# EasyEDA Pro project Excam多功能小相机.epro, board PCB3
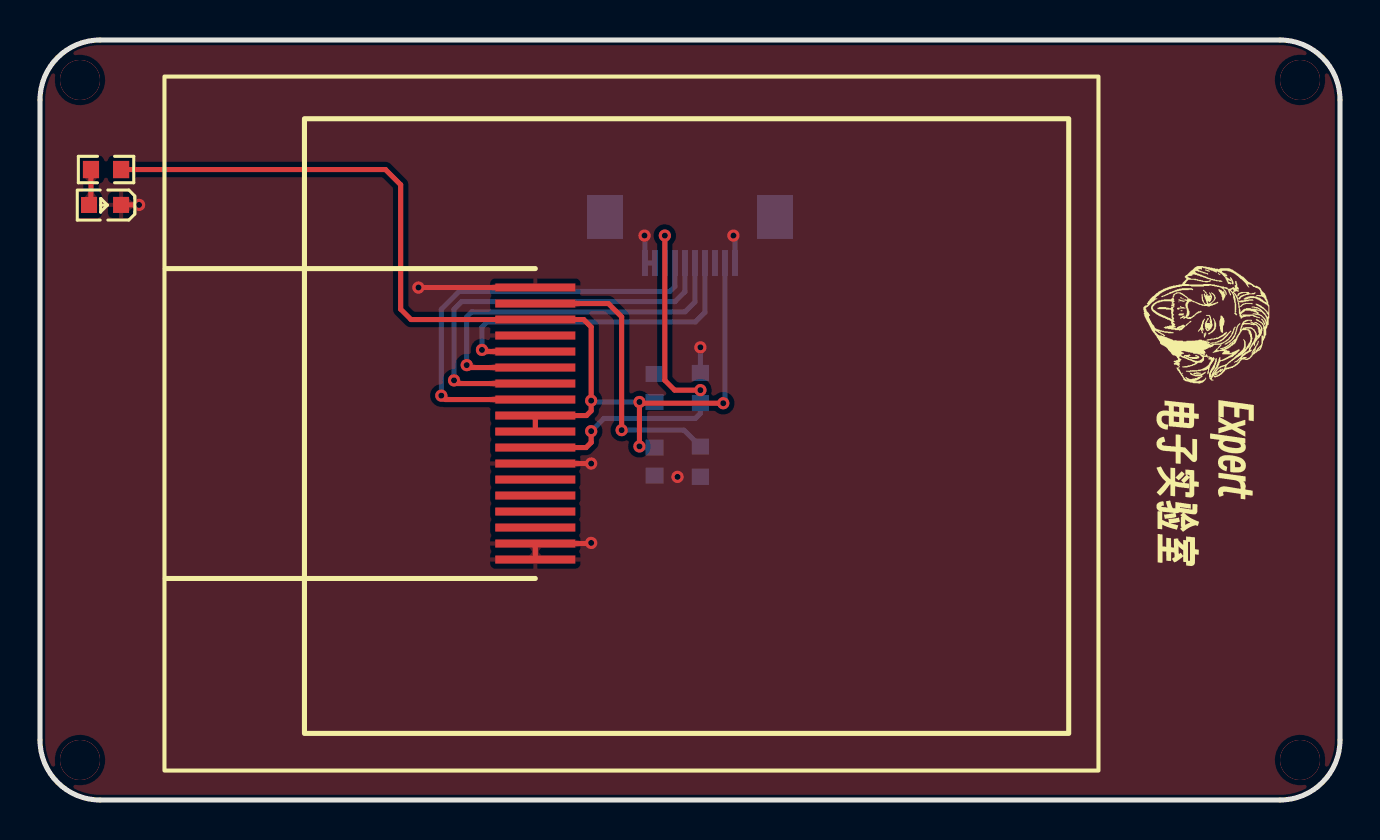
[diagram p2: board, top side]
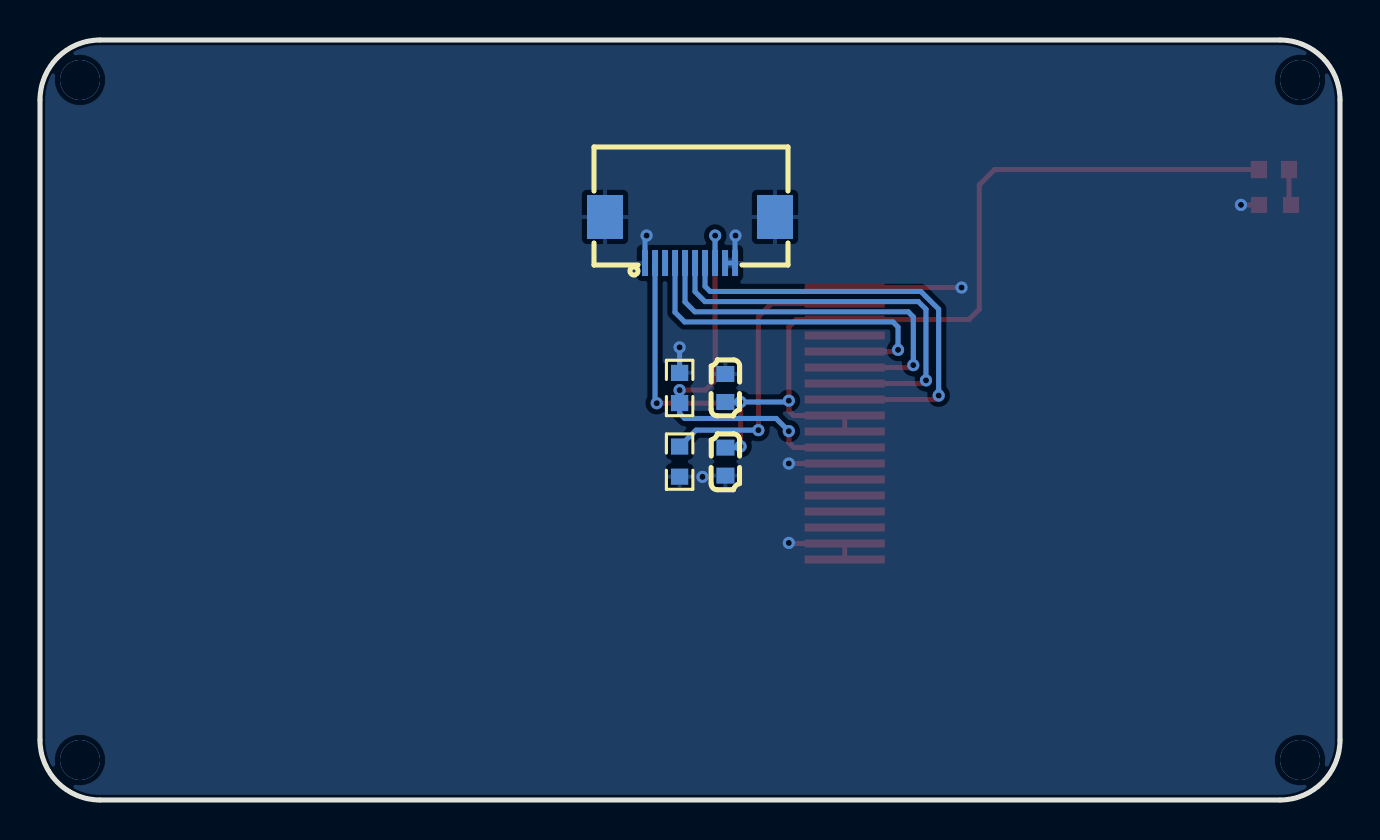
[diagram p3: board, bottom side, seen from below]

Outline 65 x 38 mm; copper layers: Top Layer, Bottom Layer. Coordinates in mm from the lower left corner of the outline.
Outline path: 0,35 0,3 arc(0.88,0.88) 3,0 62,0 arc(64.12,0.88) 65,3 65,35 arc(64.12,37.12) 62,38 3,38 arc(0.88,37.12) 0,35
Stack: Top Layer 0.035mm / Dielectric1 1.51mm FR4 er 4.5 / Bottom Layer 0.035mm

## Design rules (mm)
template: JLCPCB Capability(Two Layers Board)
spacing copperThickness1oz (default): track to track 0.102, other pairs 0.152 to 0.3
spacing copperThickness2oz: track to track 0.203, other pairs 0.152 to 0.3
track width copperThickness1oz (default): min 0.127, default 0.254, max 2.54
track width copperThickness2oz: min 0.203, default 0.254, max 2.54
differential pair differentialPair (default): width min 0.127, default 0.254, max 2.54; gap min 0.152, default 0.152
via viaSize (default): diameter min 0.5, default 0.61, max 10; hole min 0.3, default 0.305, max 6.3

## Placement (name value [footprint] x y rotation side)
C1  100nF  [C0603]  30.73 16.92 90 bottom
C2  10uF  [C0603]  30.73 20.6 270 bottom
FPC3  F-FPC0M10P-C310  [FPC-SMD_P0.50-10P_FGS]  32.5 28 0 bottom
LED1  -  [LED_0603]  3.2 29.75 180 top
R5  10K  [R0603]  33.02 20.6 270 bottom
R6  10K  [R0603]  3.3 31.52 0 top
R7  10  [R0603]  33.02 16.92 90 bottom
TFT1  -  [ST7735S_1.8inch_18pin]  24.76 18.82 0 top

## Footprints (pads in the part's own frame, mm; a bottom-side part is the same pattern mirrored in y, then rotated)
C0603
  rect 0.8x0.9 smd: 1(-0.7,0) 2(0.7,0)
FPC-SMD_P0.50-10P_FGS
  rect 0.3x1.3 smd: 1(2.25,1.149) 2(1.748,1.151) 3(1.248,1.151) 4(0.748,1.151) 5(0.248,1.151) 6(-0.252,1.151) 7(-0.752,1.151) 8(-1.252,1.151) 9(-1.752,1.151) 10(-2.252,1.151)
  rect 1.8x2.2 smd: 11(-4.25,-1.151) 12(4.25,-1.151)
LED_0603
  rect 0.8x0.8 smd: 1(-0.851,-0.01) 2(0.75,-0.005)
R0603
  rect 0.806x0.864 smd: 1(-0.753,0) 2(0.753,0)
ST7735S_1.8inch_18pin
  rect 4x0.4 smd: 1(0,6.8) 2(0,6) 3(0,5.2) 4(0,4.4) 5(0,3.6) 6(0,2.8) 7(0,2) 8(0,1.2) 9(0,0.4) 10(0,-0.4) 11(0,-1.2) 12(0,-2) 13(0,-2.8) 14(0,-3.6) 15(0,-4.4) 16(0,-5.2) 17(0,-6) 18(0,-6.8)

## Nets
3V3: C1.2 C2.2 FPC3.2 R6.2 TFT1.3 TFT1.9 TFT1.10
GND: C1.1 C2.1 FPC3.1 FPC3.9 FPC3.10 FPC3.11 FPC3.12 LED1.1 R5.1 R7.1 TFT1.1 TFT1.4 TFT1.12 TFT1.17 TFT1.18
SPI2_MOSI: FPC3.6 TFT1.7
SPI2_NSS: FPC3.8 R5.2 TFT1.11
SPI2_SCLK: FPC3.7 TFT1.8
TIM4_CH1: FPC3.4 TFT1.5
TIM4_CH2: FPC3.5 TFT1.6
$1N513: R7.2 TFT1.2
$1N1327: LED1.2 R6.1

Pads without a net: FPC3 3; TFT1 13 14 15 16

## Via types
v1: diameter 2, hole 2, Top Layer to Bottom Layer, 4 vias
v2: diameter 0.61, hole 0.305, Top Layer to Bottom Layer, 20 vias

## Routing (per net, layer and track width the routed paths; a pad name or vN(x,y) marks a point on that pad's centre or on a via; arc(x,y) is an arc through that point)
3V3: length 55.8
  Top Layer w0.254: v2(34.16,19.84) 30.03,19.84 v2(29.97,19.9) v2(29.97,17.68) ; R6.2 17.27,31.52 18.03,30.76 18.03,24.54 18.55,24.02 TFT1.3 27.19,24.02 27.56,23.65 v2(27.56,19.97) 27.56,19.46 27.32,19.22 TFT1.9 24.76,18.42
  Bottom Layer w0.254: v2(34.16,19.84) 34.25,19.92 FPC3.2 ; v2(27.56,19.97) 27.62,19.9 v2(29.97,19.9) C2.2 ; C1.2 30.03,17.62 v2(29.97,17.68)
GND: length 17.7
  Top Layer w0.254: LED1.1 v2(4.95,29.75) ; 24.76,25.62 v2(18.92,25.62) ; v2(27.56,12.85) 27.53,12.82 TFT1.17 TFT1.18 ; TFT1.12 v2(27.56,16.82)
  Bottom Layer w0.254: v2(30.23,28.22) 30.25,28.2 FPC3.10 FPC3.9 ; v2(34.67,28.22) 34.75,28.14 FPC3.1 ; v2(33.02,22.63) R5.1
  vias: v2(31.88,16.16)
(no net):
  vias: v1(2,36) v1(2,2) v1(63,36) v1(63,2)
SPI2_MOSI: length 21
  Top Layer w0.254: v2(20.7,20.98) 20.86,20.82 TFT1.7
  Bottom Layer w0.254: FPC3.6 32.25,25.42 31.75,24.92 21.08,24.92 20.7,24.54 v2(20.7,20.98)
SPI2_NSS: length 21
  Top Layer w0.254: 24.76,17.62 27.31,17.62 27.56,17.88 v2(27.56,18.44) ; v2(31.24,28.22) 31.24,20.98 31.73,20.49 v2(33.02,20.49)
  Bottom Layer w0.254: v2(33.02,20.49) R5.2 33.02,19.33 32.77,19.08 28.19,19.08 v2(27.56,18.44) ; FPC3.8 31.25,28.22 v2(31.24,28.22)
SPI2_SCLK: length 22.4
  Top Layer w0.254: v2(20.07,20.22) 20.26,20.02 TFT1.8
  Bottom Layer w0.254: FPC3.7 31.75,25.68 31.49,25.43 20.96,25.43 20.07,24.54 v2(20.07,20.22)
TIM4_CH1: length 17.8
  Top Layer w0.254: 24.76,22.42 22.18,22.42 v2(22.1,22.51)
  Bottom Layer w0.254: FPC3.4 33.25,24.39 32.77,23.9 22.35,23.9 22.1,23.65 v2(22.1,22.51)
TIM4_CH2: length 19.6
  Top Layer w0.254: 24.76,21.62 21.46,21.62 v2(21.34,21.74)
  Bottom Layer w0.254: FPC3.5 32.75,24.9 32.26,24.41 21.59,24.41 21.34,24.16 v2(21.34,21.74)
$1N513: length 14.5
  Top Layer w0.254: v2(29.08,18.49) 29.08,24.16 28.42,24.82 TFT1.2
  Bottom Layer w0.254: R7.2 32.2,18.49 v2(29.08,18.49)
$1N1327: length 1.8
  Top Layer w0.254: R6.1 2.55,29.85 LED1.2

## Copper pours and planes (outline as drawn; the poured copper is in the pictures)
GND on Top Layer: -2.03,38.89 66.29,38.89 66.29,-1.5 -2.03,-1.5
GND on Bottom Layer: -2.54,40.41 66.68,40.41 66.68,-2.26 -2.54,-2.26

Small or netless copper shapes (teardrops, artwork), in the pictures only: 21 on Top Layer, 6 on Bottom Layer
